# EAGLE schematic ESP-WROOM32-Breakout_v10 (EAGLE 7.7.0)
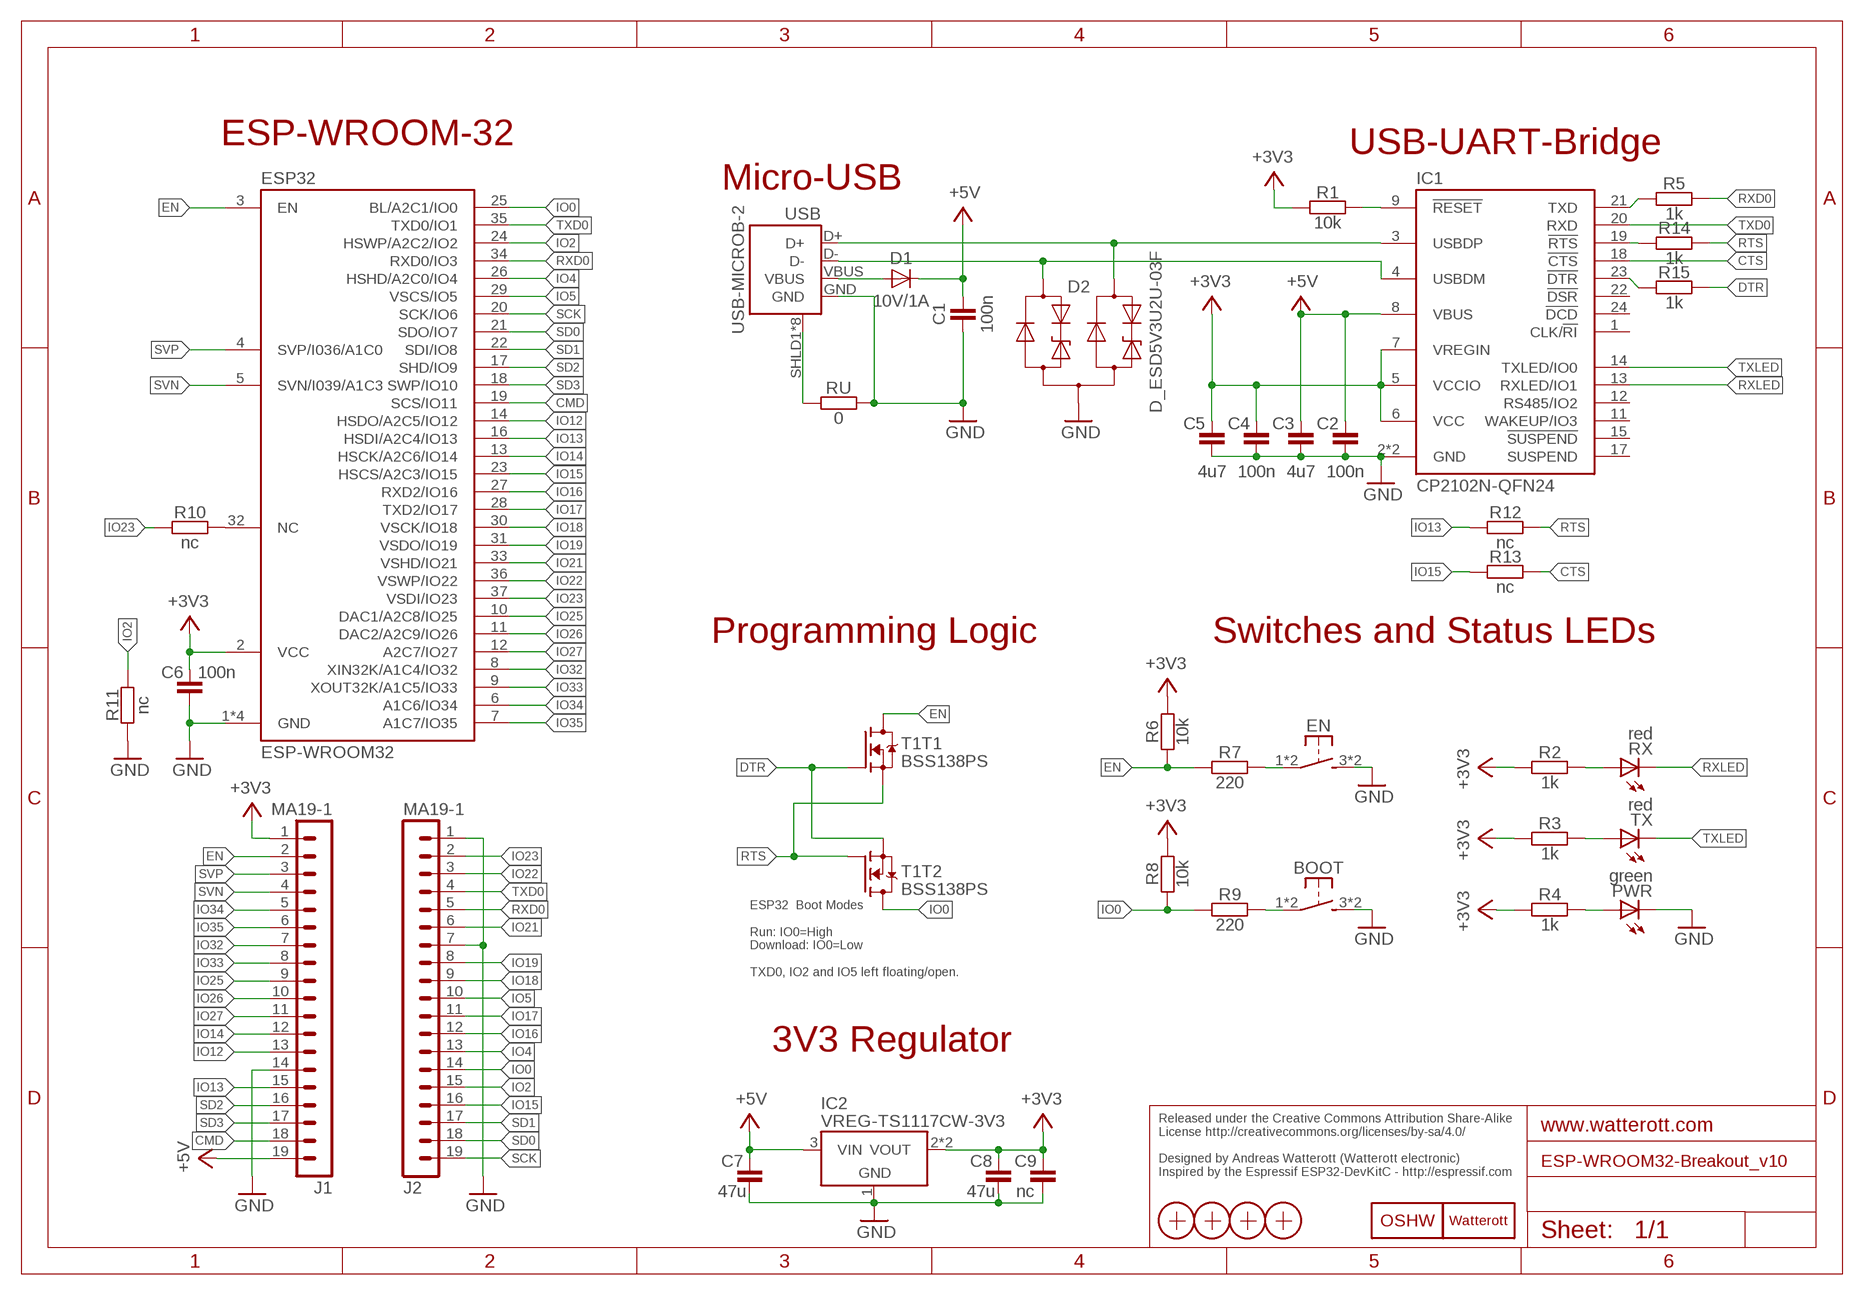
[diagram p0: schematic, sheet 1]

## Parts
BOOT  SW-TACTILE-PTS840P  [PTS840P]
C1  100n  CAPACITOR-0402  [C0402]
C2  100n  CAPACITOR-0402  [C0402]
C3  4u7  CAPACITOR-0603  [C0603]
C4  100n  CAPACITOR-0402  [C0402]
C5  4u7  CAPACITOR-0603  [C0603]
C6  100n  CAPACITOR-0402  [C0402]
C7  47u  CAPACITOR-1206  [C1206]
C8  47u  CAPACITOR-1206  [C1206]
C9  nc  CAPACITOR-1206  [C1206]
D1  10V/1A  DIODE-SMA  [SMA_DO214AC]
D2  D_ESD5V3U2U-03F  [SOT723]
EN  SW-TACTILE-PTS840P  [PTS840P]
ESP32  ESP-WROOM32  [ESP-WROOM32]
IC1  CP2102N-QFN24  [QFN24-PAD]
IC2  VREG-TS1117CW-3V3  [SOT223]
J1  MA19-1  [MA19-1]
J2  MA19-1  [MA19-1]
LOGO2  OSHW_LOGOX0070  [OSHW_6X70]
LOGO4  LOGO-S_PLACE_M  [SPARK_TPLACE_M]
PWR  green  LED-0603  [C0603]
R1  10k  RESISTOR-0402  [C0402]
R2  1k  RESISTOR-0402  [C0402]
R3  1k  RESISTOR-0402  [C0402]
R4  1k  RESISTOR-0402  [C0402]
R5  1k  RESISTOR-0402  [C0402]
R6  10k  RESISTOR-0402  [C0402]
R7  220  RESISTOR-0402  [C0402]
R8  10k  RESISTOR-0402  [C0402]
R9  220  RESISTOR-0402  [C0402]
R10  nc  RESISTOR-0402  [C0402]
R11  nc  RESISTOR-0402  [C0402]
R12  nc  RESISTOR-0402  [C0402]
R13  nc  RESISTOR-0402  [C0402]
R14  1k  RESISTOR-0402  [C0402]
R15  1k  RESISTOR-0402  [C0402]
RU  0  RESISTOR-0402  [C0402]
RX  red  LED-0603  [C0603]
T1  BSS138PS  [SOT363]
TX  red  LED-0603  [C0603]
USB  USB-MICROB-2  [USB-MICROB-10118194]
X1  PASSER-07  [PASSER_07MM]
X2  PASSER-07  [PASSER_07MM]
X3  PASSER-07  [PASSER_07MM]
X4  PASSER-07  [PASSER_07MM]

## Nets
+3V3: C4.2 C5.2 C6.2 C8.2 C9.2 ESP32.2(VCC) IC1.5(VCCIO) IC1.6(VCC) IC1.7(VREGIN) IC2.2(VOUT) IC2.4(VOUT) J1.1 R1.1 R2.1 R3.1 R4.1 R6.2 R8.2
+5V: C1.2 C2.2 C3.2 C7.2 D1.C IC1.8(VBUS) IC2.3(VIN) J1.19
CMD: ESP32.19(SCS/IO11) J1.18
CPDTR: IC1.23(!DTR) R15.1
CPRTS: IC1.19(!RTS) R14.1
CPTX: IC1.21(TXD) R5.1
CTS: IC1.18(!CTS) R13.2
D_N: D2.1(C1) IC1.4(USBDM) USB.D-
D_P: D2.2(C2) IC1.3(USBDP) USB.D+
DTR: R15.2 T1.2(T1:G) T1.4(T2:S)
EN: ESP32.3(EN) J1.2 R6.1 R7.1 T1.6(T1:D)
GND: BOOT.3(S1) BOOT.4(S1) C1.1 C2.1 C3.1 C4.1 C5.1 C6.1 C7.1 C8.1 C9.1 D2.3(A) EN.3(S1) EN.4(S1) ESP32.1(GND) ESP32.15(GND) ESP32.38(GND) ESP32.TP(GND) IC1.2(GND) IC1.TP(GND) IC2.1(GND) J1.14 J2.1 J2.7 PWR.C R11.1 RU.2 USB.GND
IO0: ESP32.25(BL/A2C1/IO0) J2.14 R8.1 R9.1 T1.3(T2:D)
IO2: ESP32.24(HSWP/A2C2/IO2) J2.15 R11.2
IO4: ESP32.26(HSHD/A2C0/IO4) J2.13
IO5: ESP32.29(VSCS/IO5) J2.10
IO12: ESP32.14(HSDO/A2C5/IO12) J1.13
IO13: ESP32.16(HSDI/A2C4/IO13) J1.15 R12.1
IO14: ESP32.13(HSCK/A2C6/IO14) J1.12
IO15: ESP32.23(HSCS/A2C3/IO15) J2.16 R13.1
IO16: ESP32.27(RXD2/IO16) J2.12
IO17: ESP32.28(TXD2/IO17) J2.11
IO18: ESP32.30(VSCK/IO18) J2.9
IO19: ESP32.31(VSDO/IO19) J2.8
IO21: ESP32.33(VSHD/IO21) J2.6
IO22: ESP32.36(VSWP/IO22) J2.3
IO23: ESP32.37(VSDI/IO23) J2.2 R10.1
IO25: ESP32.10(DAC1/A2C8/IO25) J1.9
IO26: ESP32.11(DAC2/A2C9/IO26) J1.10
IO27: ESP32.12(A2C7/IO27) J1.11
IO32: ESP32.8(XIN32K/A1C4/IO32) J1.7
IO33: ESP32.9(XOUT32K/A1C5/IO33) J1.8
IO34: ESP32.6(A1C6/IO34) J1.5
IO35: ESP32.7(A1C7/IO35) J1.6
N$1: EN.1 EN.2(P1) R7.2
N$2: BOOT.1 BOOT.2(P1) R9.2
NC: ESP32.32(NC) R10.2
PWR-LED: PWR.A R4.2
RESET: IC1.9(!RESET) R1.2
RTS: R12.2 R14.2 T1.1(T1:S) T1.5(T2:G)
RX-LED: R2.2 RX.A
RXD0: ESP32.34(RXD0/IO3) J2.5 R5.2
RXLED: IC1.13(RXLED/IO1) RX.C
SCK: ESP32.20(SCK/IO6) J2.19
SD0: ESP32.21(SDO/IO7) J2.18
SD1: ESP32.22(SDI/IO8) J2.17
SD2: ESP32.17(SHD/IO9) J1.16
SD3: ESP32.18(SWP/IO10) J1.17
SHLD: RU.1 USB.SHLD1(SHIELD) USB.SHLD2(SHIELD) USB.SHLD3(SHIELD) USB.SHLD4(SHIELD) USB.SHLD5(SHIELD) USB.SHLD6(SHIELD) USB.SHLD7(SHIELD) USB.SHLD8(SHIELD)
SVN: ESP32.5(SVN/I039/A1C3) J1.4
SVP: ESP32.4(SVP/I036/A1C0) J1.3
TX-LED: R3.2 TX.A
TXD0: ESP32.35(TXD0/IO1) IC1.20(RXD) J2.4
TXLED: IC1.14(TXLED/IO0) TX.C
VBUS: D1.A USB.VBUS
Unconnected: IC1.1(CLK/!RI) IC1.11(WAKEUP/IO3) IC1.12(RS485/IO2) IC1.15(!SUSPEND) IC1.17(SUSPEND) IC1.22(!DSR) IC1.24(!DCD)

## Notes on the sheet
- ESP-WROOM-32 | USB-UART-Bridge
- Micro-USB
- Programming Logic | Switches and Status LEDs
- ESP32  Boot Modes
  
  Run: IO0=High
  Download: IO0=Low
  
  TXD0, IO2 and IO5 left floating/open.
- 3V3 Regulator
- Released under the Creative Commons Attribution Share-Alike
  License http://creativecommons.org/licenses/by-sa/4.0/
  
  Designed by Andreas Watterott (Watterott electronic)
  Inspired by the Espressif ESP32-DevKitC - http://espressif.com

## Library data of the parts
BOOT EN = we-switch:SW-TACTILE: Tactile Switches; DIGIKEY: CKN10511DKR-ND
C1-C9 = we-rcl:CAPACITOR: Capacitors ...2.2uF @ 6.3V -> 0402 ...4.7uF @ 6.3V -> 0603 ...10uF @ 16V -> 0805 ...22uF @ 25V -> 1206
D1 = we-rcl:DIODE: Diodes
D2 = we-rcl:D_ESD5V3U2U: TVS Diode - Uni-directional Ultra Low ESD / Transient Protection Diode Vrwm=5.3V, 0.4pF@1MHz; DIGIKEY: ESD5V3U2U-03F H6327DKR-ND
ESP32 = we-chip:ESP-WROOM32: Espressif ESP-WROOM-32 ESP32 WiFi/WLAN + Bluetooth/BLE Module Compatible with AI-Thinker ESP-32S Module.
IC1 = we-chip:CP2102N: Silabs CP2102N USB to UART Bridge (5V tolerant inputs) CP2102N-QFN24 is pin-compatible with CP2104.
IC2 = we-power:VREG: Voltage Regulators (LDOs, Switching Converters...) LDOs Taiwan Semi TS1117 800mA max 15V - compatible On Semi NCP1117 1A max 20V Taiwan Semi TS9011 250mA max 12V - compatible Diodes AP2210 300mA max 15V - compatible Microchip MCP1702 250mA max 13V - compatible Microchip MCP1703 250mA max 16V - compatible Microchip MCP1754 150mA max 16V Taiwan Semi TS5204 150mA max 16V (low noise) DC/DC Converter Modules Recom R-78Ex.x-1.0-W36 1A max 28V Murata OKI-78SR-x.x/1.5-W36 1.5A max 36V CUI V78xx-2000 2A max 18V
J1 J2 = we-con:MA19-1: Pin Header
LOGO2 = we-symbol:OSHW_LOGO: Open-Source-Hardware Logo
LOGO4 = we-symbol:LOGO: Watterott electronic Logo
PWR RX TX = we-opto:LED: LEDs red, green, blue -> 0603
R1-R15 RU = we-rcl:RESISTOR: Resistors all kinds in 0402 and 0603
T1 = we-transistor:BSS138PS: Dual N-Channel MOSFET BSS138 (Vgs>=+/-20V, Vds>=40V, Id>=0.2A + Rds<=3Ohm @ Vgs=4.5V)
USB = we-con:USB: USB Connectors; DIGIKEY: 609-4618-6-ND
X1-X4 = we-symbol:PASSER: Fiducial Markers